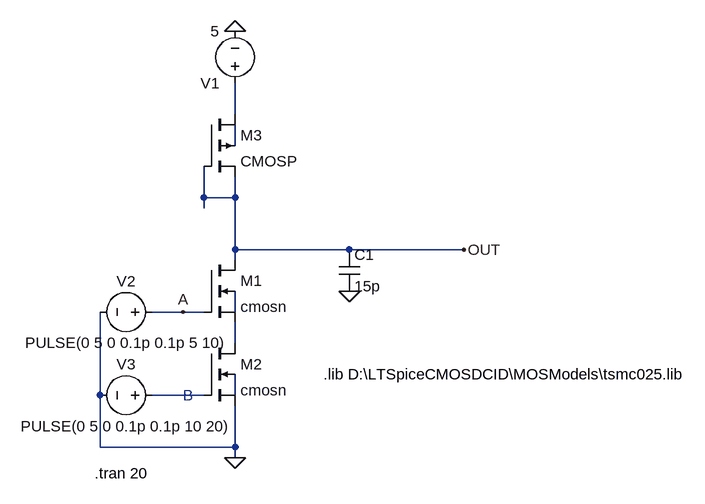
[diagram p0: schematic 250n_nand_depletion.asc]
250n_nand_depletion.asc, the LTspice schematic file:
Version 4
SHEET 1 1040 680
WIRE 304 -160 304 -208
WIRE 304 -112 304 -144
WIRE 256 -32 256 -80
WIRE 304 -32 304 -64
WIRE 304 -32 256 -32
WIRE 256 -16 256 -32
WIRE 304 48 304 -32
WIRE 480 48 304 48
WIRE 656 48 480 48
WIRE 304 64 304 48
WIRE 224 144 176 144
WIRE 256 144 224 144
WIRE 304 144 304 112
WIRE 304 192 304 160
WIRE 96 272 96 144
WIRE 256 272 176 272
WIRE 304 272 304 240
WIRE 96 352 96 272
WIRE 304 352 304 288
WIRE 304 352 96 352
WIRE 304 368 304 352
FLAG 304 368 0
FLAG 304 -288 0
FLAG 656 48 OUT
FLAG 224 144 A
FLAG 480 112 0
SYMBOL nmos4 256 64 R0
SYMATTR InstName M1
SYMATTR Value cmosn
SYMATTR Value2 l=250n w=360n ad=0.1728p as=0.1728p pd=1680n ps=1680n
SYMBOL nmos4 256 192 R0
SYMATTR InstName M2
SYMATTR Value cmosn
SYMATTR Value2 l=250n w=360n ad=0.1728p as=0.1728p pd=1680n ps=1680n
SYMBOL voltage 304 -192 R180
WINDOW 123 0 0 Left 0
WINDOW 39 0 0 Left 0
SYMATTR InstName V1
SYMATTR Value 5
SYMBOL voltage 192 144 R90
WINDOW 0 -32 56 VBottom 2
WINDOW 3 32 56 VTop 2
WINDOW 123 0 0 Left 0
WINDOW 39 0 0 Left 0
SYMATTR InstName V2
SYMATTR Value PULSE(0 5 0 0.1p 0.1p 5 10)
SYMBOL voltage 192 272 R90
WINDOW 0 -32 56 VBottom 2
WINDOW 3 32 56 VTop 2
WINDOW 123 0 0 Left 0
WINDOW 39 0 0 Left 0
SYMATTR InstName V3
SYMATTR Value PULSE(0 5 0 0.1p 0.1p 10 20)
SYMBOL cap 464 48 R0
SYMATTR InstName C1
SYMATTR Value 15p
SYMBOL pmos4 256 -160 R0
SYMATTR InstName M3
SYMATTR Value CMOSP
SYMATTR Value2 l=250n w=1440n ad=0.1728p as=0.1728p pd=1680n ps=1680n
TEXT 88 392 Left 2 !.tran 20
TEXT 224 272 Left 2 ;B
TEXT 440 240 Left 2 !.lib D:\\LTSpiceCMOSDCID\\MOSModels\\tsmc025.lib

The netlist it stands for:
* 250n_nand_depletion.asc
M1 OUT A N004 N003 cmosn l=250n w=360n ad=0.1728p as=0.1728p pd=1680n ps=1680n
M2 N004 N005 0 N006 cmosn l=250n w=360n ad=0.1728p as=0.1728p pd=1680n ps=1680n
V1 N001 0 5
V2 A 0 PULSE(0 5 0 0.1p 0.1p 5 10)
V3 N005 0 PULSE(0 5 0 0.1p 0.1p 10 20)
C1 OUT 0 15p
M3 N001 OUT OUT N002 CMOSP l=250n w=1440n ad=0.1728p as=0.1728p pd=1680n ps=1680n
.model NMOS NMOS
.model PMOS PMOS
.lib standard.mos
.tran 20
* B
.lib D:\LTSpiceCMOSDCID\MOSModels\tsmc025.lib
.backanno
.end